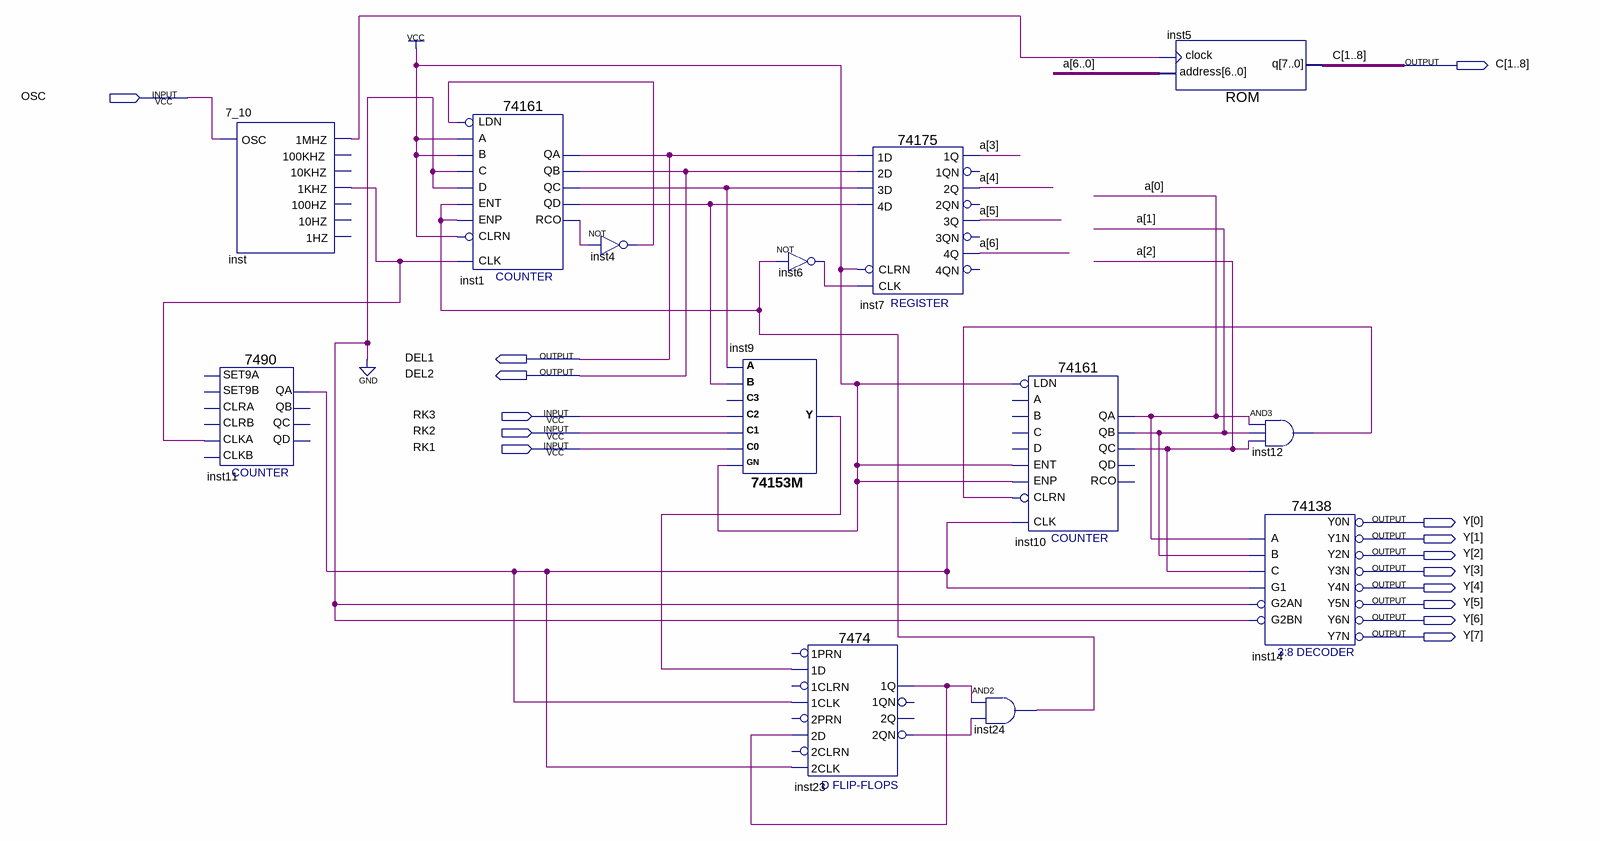
[diagram p0: schematic sheet]
// Quartus schematic LED.bdf as structural Verilog: 13 symbols, 15 pins
module LED (
  input  OSC,
  input  RK3,
  input  RK2,
  input  RK1,
  output [1:8] C,
  output DEL1,
  output DEL2,
  output [7:0] Y
);

  wire inst1_qc, inst1_qd, inst1_rco, inst4_out, inst6_out, inst9_y, inst11_qa, inst12_out, inst23_1q,
       inst23_2qn, inst24_out, inst_1khz, inst_1mhz;
  wire [6:0] a;

  \7_10  inst (.OSC(OSC), .\1MHZ (inst_1mhz), .\1KHZ (inst_1khz));  // open: 100KHZ, 10KHZ, 100HZ, 10HZ, 1HZ
  \7490  inst11 (.CLKA(inst_1khz), .QA(inst11_qa));  // open: SET9A, CLRA, SET9B, CLKB, CLRB, QD, QB, QC
  \74161  inst1 (
    .CLRN(1'b1), .CLK(inst_1khz), .ENP(inst24_out), .LDN(inst4_out), .A(1'b1), .D(1'b0), .ENT(inst24_out),
    .B(1'b1), .C(1'b0), .QD(inst1_qd), .QC(inst1_qc), .QB(DEL2), .QA(DEL1), .RCO(inst1_rco));
  not inst4 (inst4_out, inst1_rco);
  \74153M  inst9 (.A(inst1_qc), .B(inst1_qd), .C2(RK3), .C1(RK2), .C0(RK1), .GN(1'b1), .Y(inst9_y));  // open: C3
  not inst6 (inst6_out, inst24_out);
  \7474  inst23 (
    .\2D (inst23_1q), .\1CLK (inst11_qa), .\1D (inst9_y), .\2CLK (inst11_qa), .\2QN (inst23_2qn),
    .\1Q (inst23_1q));  // open: 2PRN, 1PRN, 2CLRN, 1CLRN, 1QN, 2Q
  \74175  inst7 (
    .CLRN(1'b1), .CLK(inst6_out), .\3D (inst1_qc), .\2D (DEL2), .\1D (DEL1), .\4D (inst1_qd), .\1Q (a[3]),
    .\3Q (a[5]), .\2Q (a[4]), .\4Q (a[6]));  // open: 1QN, 2QN, 4QN, 3QN
  \74161  inst10 (
    .CLRN(inst12_out), .CLK(inst11_qa), .ENP(1'b1), .LDN(1'b1), .ENT(1'b1), .QC(a[2]), .QB(a[1]), .QA(a[0]));  // open: A, D, B, C, QD, RCO
  and inst24 (inst24_out, inst23_1q, inst23_2qn);
  ROM inst5 (.address(a), .clock(inst_1mhz), .q(C));
  and inst12 (inst12_out, a[0], a[1], a[2]);
  \74138  inst14 (
    .A(a[0]), .B(a[1]), .G1(inst11_qa), .C(a[2]), .G2AN(1'b0), .G2BN(1'b0), .Y0N(Y[0]), .Y1N(Y[1]),
    .Y2N(Y[2]), .Y3N(Y[3]), .Y4N(Y[4]), .Y5N(Y[5]), .Y6N(Y[6]), .Y7N(Y[7]));
endmodule
